# EAGLE schematic r0.2.6 (EAGLE 7.2.0)
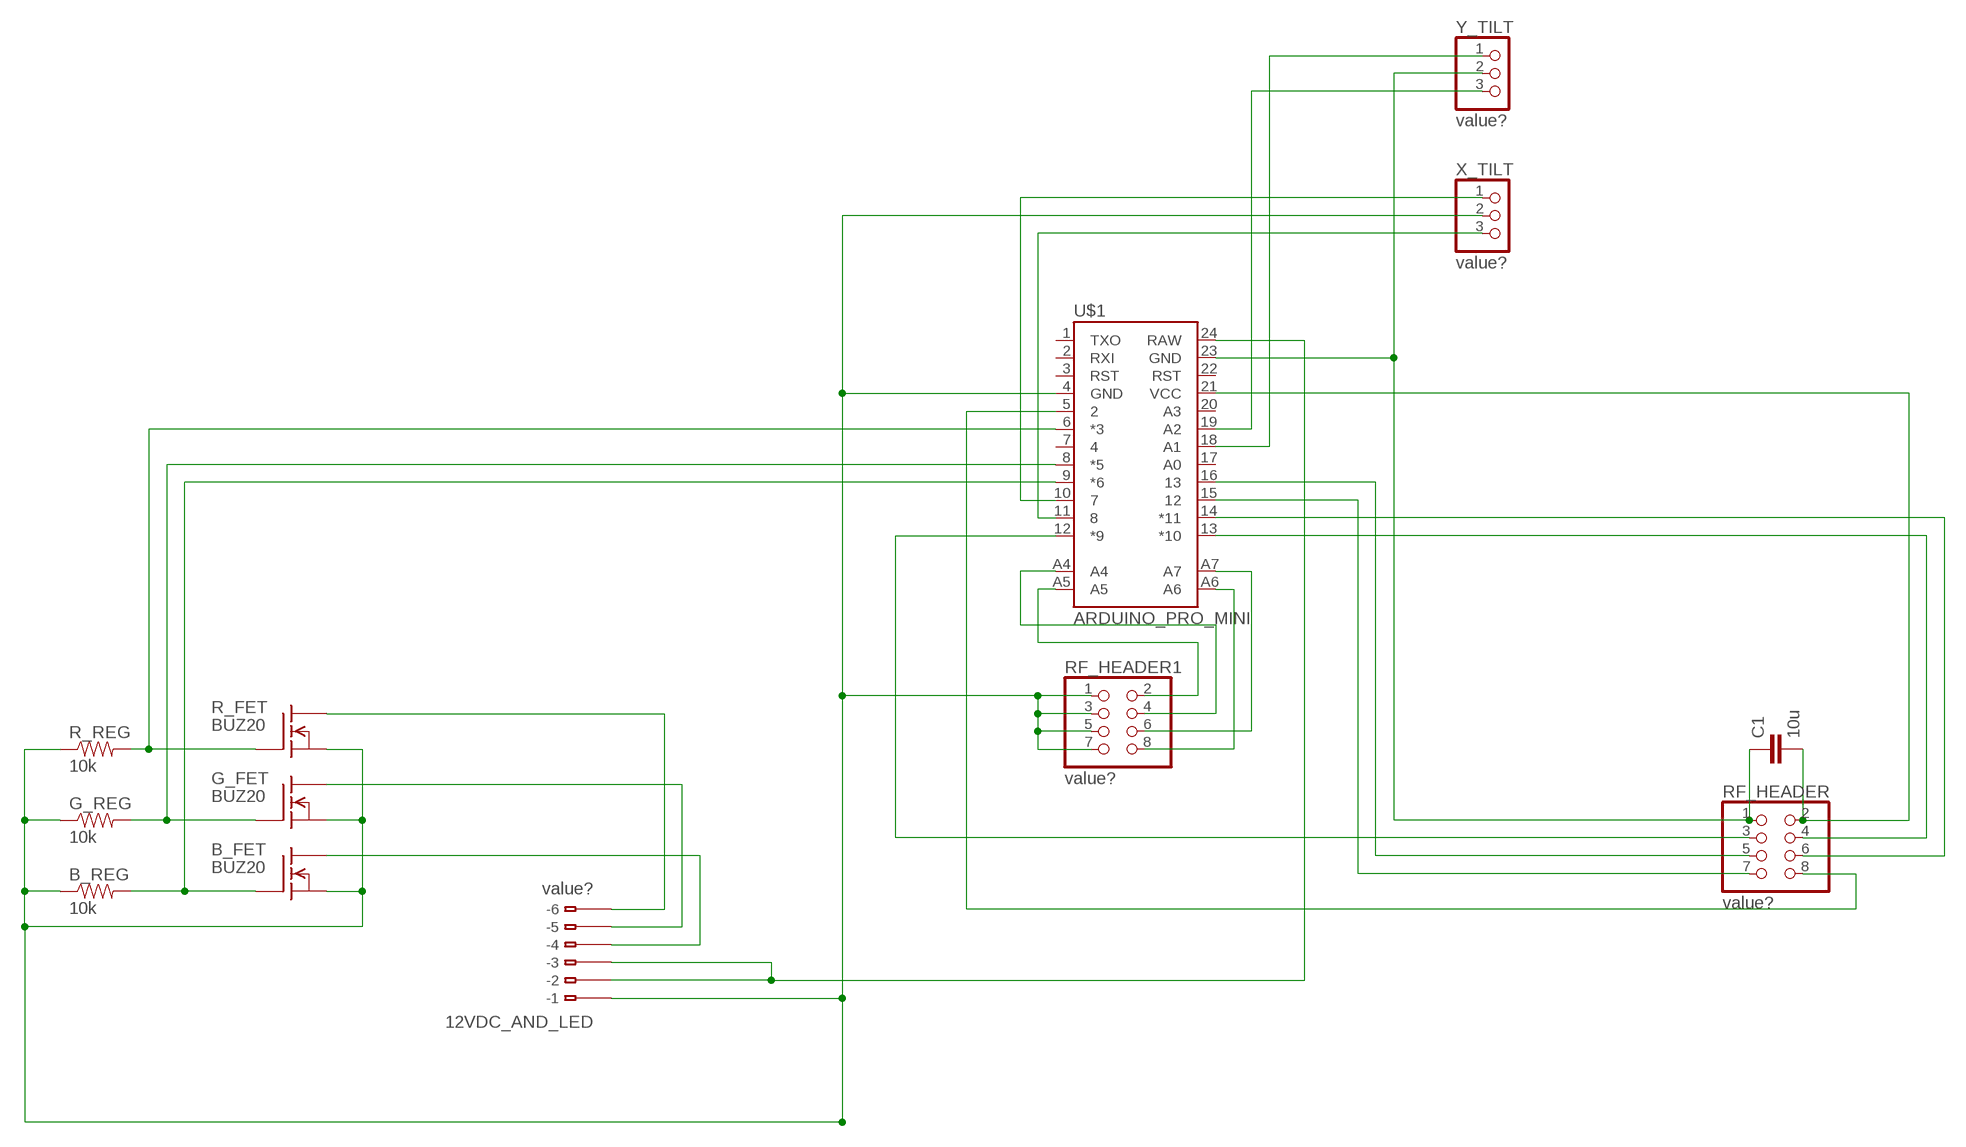
[diagram p0: schematic, sheet 1]

## Parts
12VDC_AND_LED  value?  234-206  [234-206]
B_FET  BUZ20  [TO220]
B_REG  10k  RESISTORPTH-1/4W  [AXIAL-0.4]
C1  10u  CAPPTH  [CAP-PTH-SMALL]
G_FET  BUZ20  [TO220]
G_REG  10k  RESISTORPTH-1/4W  [AXIAL-0.4]
R_FET  BUZ20  [TO220]
R_REG  10k  RESISTORPTH-1/4W  [AXIAL-0.4]
RF_HEADER  value?  PINHD-2X4  [2X04]
RF_HEADER1  value?  PINHD-2X4  [2X04]
U$1  ARDUINO_PRO_MINI  [ARDUINO_PRO_MINI]
X_TILT  value?  PINHD-1X3  [1X03]
Y_TILT  value?  PINHD-1X3  [1X03]

## Nets
N$1: U$1.10 X_TILT.1
N$2: B_FET.1(G) B_REG.P$2 U$1.9(*6)
N$3: R_FET.1(G) R_REG.P$2 U$1.6(*3)
N$4: 12VDC_AND_LED.B5(B-5) G_FET.2(D)
N$5: 12VDC_AND_LED.B4(B-4) B_FET.2(D)
N$6: U$1.11 X_TILT.3
N$7: 12VDC_AND_LED.B6(B-6) R_FET.2(D)
N$9: 12VDC_AND_LED.B2(B-2) 12VDC_AND_LED.B3(B-3) U$1.24(RAW)
N$10: C1.1 RF_HEADER.1 U$1.23(GND) Y_TILT.2
N$11: 12VDC_AND_LED.B1(B-1) B_FET.3(S) B_REG.P$1 G_FET.3(S) G_REG.P$1 R_FET.3(S) R_REG.P$1 RF_HEADER1.1 RF_HEADER1.3 RF_HEADER1.5 RF_HEADER1.7 U$1.4(GND) X_TILT.2
N$12: RF_HEADER1.4 U$1.A4
N$13: G_FET.1(G) G_REG.P$2 U$1.8(*5)
N$14: U$1.19(A2) Y_TILT.3
N$15: RF_HEADER.3 U$1.12(*9)
N$16: RF_HEADER.4 U$1.13(*10)
N$17: RF_HEADER.6 U$1.14(*11)
N$18: RF_HEADER1.2 U$1.A5
N$19: RF_HEADER1.8 U$1.A6
N$20: RF_HEADER1.6 U$1.A7
N$21: RF_HEADER.7 U$1.15
N$23: RF_HEADER.5 U$1.16
N$25: RF_HEADER.8 U$1.5
N$27: U$1.18(A1) Y_TILT.1
Y_TILT: C1.2 RF_HEADER.2 U$1.21(VCC)
Unconnected: 12VDC_AND_LED.A1(-1) 12VDC_AND_LED.A2(-2) 12VDC_AND_LED.A3(-3) 12VDC_AND_LED.A4(-4) 12VDC_AND_LED.A5(-5) 12VDC_AND_LED.A6(-6) U$1.1(TXO) U$1.2(RXI) U$1.3(RST) U$1.7 U$1.17(A0) U$1.20(A3) U$1.22(RST)

## Library data of the parts
12VDC_AND_LED = con-wago:234-206: WAGO Cage Clamp; MPN: 234-206; OC_FARNELL: unknown; OC_NEWARK: 28K9095
B_FET G_FET R_FET = MyMosfet:BUZ20: N-Channel Enhancement MOSFET 100V; 12A; 0,2Ohm
B_REG G_REG R_REG = SparkFun-Passives:RESISTOR: Resistor Basic schematic elements and footprints for 0603, 1206, and PTH resistors.
C1 = SparkFun-Passives:CAP: Capacitor Standard 0603 ceramic capacitor, and 0.1" leaded capacitor.
RF_HEADER RF_HEADER1 = rf-header:PINHD-2X4: PIN HEADER
U$1 = SparkFun-Boards:ARDUINO_PRO_MINI
X_TILT Y_TILT = pinhead:PINHD-1X3: PIN HEADER